# Altium schematic sheet Power.SchDoc
size 165 x 76 mm
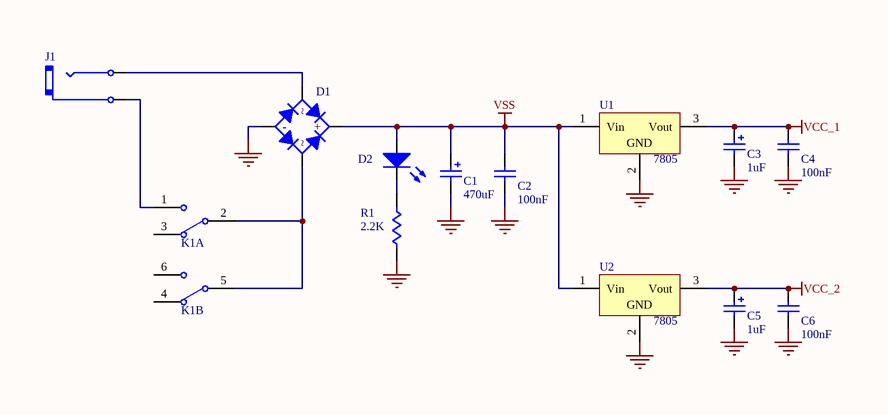
[diagram p0: Power.SchDoc]

## Parts
C1  value 470uF  [RB_3.175mm]  (hidden comment: Capacitor_1)
C2  value 100nF  [RAD_5.08MM]  (hidden comment: Capacitor_2)
C3  value 1uF  [RB_3.175mm]  (hidden comment: Capacitor_1)
C4  value 100nF  [RAD_5.08MM]  (hidden comment: Capacitor_2)
C5  value 1uF  [RB_3.175mm]  (hidden comment: Capacitor_1)
C6  value 100nF  [RAD_5.08MM]  (hidden comment: Capacitor_2)
D1  Bridge  [Bridg_2A]  (value not drawn)
D2  Optical Transmitter  [LED_5mm]  (value not drawn)
J1  Jack_Power  [Jack_Power]  (value not drawn)
K1  SW-SPDT  [KEY ON/OFF 6PIN]  (value not drawn)  (parts A,B of 2)
R1  value 2.2K  [AXIAL0.4]  (hidden comment: Resistor)
U1  value 7805  [TO257H]  (hidden comment: Volt Reg)
U2  value 7805  [TO257H]  (hidden comment: Volt Reg)

## Nets
GND: C1.2 C2.2 C3.2 C4.2 C5.2 C6.2 D1.1(-) R1.2 U1.2(GND) U2.2(GND)
VCC_1: C3.1 C4.1 U1.3(Vout)
VCC_2: C5.1 C6.1 U2.3(Vout)
VSS: C1.1 C2.1 D1.3(+) D2.1(A) U1.1(Vin) U2.1(Vin)
NetD1_2: D1.2 K1.2(COMMON) K1.5(COMMON)
NetD1_4: D1.4 J1.1(A)
NetD2_2: D2.2(K) R1.1
NetJ1_2: J1.2(B) K1.1(NO)

Not connected (* = marked no-connect by the designer): K1 3(NC) 4(NC) 6(NO)

## Library data of the parts
C1 C3 C5 = Capacitor_1: Polarized Capacitor (Radial); Manufacturer: Generic Components; Class I: Passive; Published: 8-Jun-2000; Revision: July-2002: Re-released for DXP Platform.; Publisher: Altium Limited; Class II: Capacitor
C2 C4 C6 = Capacitor_2: Polarized Capacitor (Radial); Manufacturer: Generic Components; Class I: Passive; Published: 8-Jun-2000; Revision: July-2002: Re-released for DXP Platform.; Publisher: Altium Limited; Class II: Capacitor
D1 = Bridge: Full Wave Diode Bridge; Manufacturer: Generic Components; Class I: Discrete; Class II: Rectifier - Bridge; Published: 8-Jun-2000; Revision: July-2002: Re-released for DXP Platform.; Publisher: Altium Limited
D2 = Optical Transmitter: Typical INFRARED GaAs LED; Manufacturer: Generic Components; Class I: Optoelectronic; Published: 8-Jun-2000; Revision: July-2002: Re-released for DXP Platform.; Publisher: Altium Limited; Class II: LED
J1 = Jack_Power: 2-Conductor Jack; Manufacturer: Generic Components; Class I: Connector; Revision: July-2002: Re-released for DXP Platform.; Publisher: Altium Limited
K1 = SW-SPDT: Single-Pole, Double-Throw Switch, Key; Manufacturer: Generic Components; Published: 24-Mar-1999; Revision: July-2002: Re-released for DXP Platform.; Publisher: Altium Limited
R1 = Resistor: Thermistor; Manufacturer: Generic Components; Revision: July-2002: Re-released for DXP Platform.; Publisher: Altium Limited
U1 U2 = Volt Reg: Voltage Regulator; Manufacturer: Generic Components; Class I: Power Management; Published: 24-Mar-1999; Revision: July-2002: Re-released for DXP Platform.; Publisher: Altium Limited; Class II: Voltage Regulator